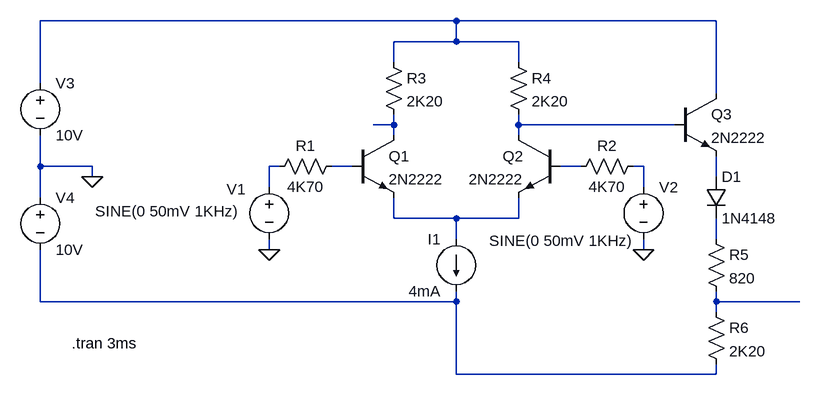
[diagram p0: schematic Exp4_PreLab_P2 copy.asc]
Exp4_PreLab_P2 copy.asc, the LTspice schematic file:
Version 4
SHEET 1 880 680
WIRE 144 -240 -496 -240
WIRE 544 -240 144 -240
WIRE 144 -208 144 -240
WIRE 144 -208 48 -208
WIRE 240 -208 144 -208
WIRE 48 -176 48 -208
WIRE 240 -176 240 -208
WIRE -496 -144 -496 -240
WIRE 544 -128 544 -240
WIRE 48 -80 48 -96
WIRE 48 -80 16 -80
WIRE 240 -80 240 -96
WIRE 480 -80 240 -80
WIRE 48 -64 48 -80
WIRE 240 -64 240 -80
WIRE -496 -16 -496 -64
WIRE -416 -16 -496 -16
WIRE -128 -16 -144 -16
WIRE -16 -16 -48 -16
WIRE 336 -16 304 -16
WIRE 432 -16 416 -16
WIRE -416 0 -416 -16
WIRE 544 0 544 -32
WIRE -144 16 -144 -16
WIRE 432 16 432 -16
WIRE -496 32 -496 -16
WIRE 48 64 48 32
WIRE 144 64 48 64
WIRE 240 64 240 32
WIRE 240 64 144 64
WIRE 144 96 144 64
WIRE 544 96 544 64
WIRE -144 112 -144 96
WIRE 432 112 432 96
WIRE -496 192 -496 112
WIRE 144 192 144 176
WIRE 144 192 -496 192
WIRE 544 192 544 176
WIRE 672 192 544 192
WIRE 544 208 544 192
WIRE 144 304 144 192
WIRE 544 304 544 288
WIRE 544 304 144 304
FLAG -144 112 0
FLAG 432 112 0
FLAG -416 0 0
SYMBOL voltage -144 0 M0
WINDOW 3 47 53 Left 2
WINDOW 0 36 19 Left 2
SYMATTR Value SINE(0 50mV 1KHz)
SYMATTR InstName V1
SYMBOL res -32 -32 R90
WINDOW 0 0 56 VBottom 2
WINDOW 3 32 56 VTop 2
SYMATTR InstName R1
SYMATTR Value 4K70
SYMBOL npn -16 -64 R0
SYMATTR InstName Q1
SYMATTR Value 2N2222
SYMBOL npn 304 -64 M0
SYMATTR InstName Q2
SYMATTR Value 2N2222
SYMBOL res 432 -32 R90
WINDOW 0 0 56 VBottom 2
WINDOW 3 32 56 VTop 2
SYMATTR InstName R2
SYMATTR Value 4K70
SYMBOL res 32 -192 R0
SYMATTR InstName R3
SYMATTR Value 2K20
SYMBOL res 224 -192 R0
SYMATTR InstName R4
SYMATTR Value 2K20
SYMBOL voltage -496 -160 R0
SYMATTR InstName V3
SYMATTR Value 10V
SYMBOL voltage -496 16 R0
SYMATTR InstName V4
SYMATTR Value 10V
SYMBOL current 144 96 M0
SYMATTR InstName I1
SYMATTR Value 4mA
SYMBOL voltage 432 0 R0
WINDOW 3 -237 98 Left 2
SYMATTR InstName V2
SYMATTR Value SINE(0 50mV 1KHz)
SYMBOL npn 480 -128 R0
SYMATTR InstName Q3
SYMATTR Value 2N2222
SYMBOL diode 528 0 R0
SYMATTR InstName D1
SYMATTR Value 1N4148
SYMBOL res 528 80 R0
SYMATTR InstName R5
SYMATTR Value 820
SYMBOL res 528 192 R0
SYMATTR InstName R6
SYMATTR Value 2K20
TEXT -448 256 Left 2 !.tran 3ms

The netlist it stands for:
* Exp4_PreLab_P2 copy.asc
V1 N004 0 SINE(0 50mV 1KHz)
R1 N005 N004 4K70
Q1 N002 N005 N009 0 2N2222
Q2 N003 N006 N009 0 2N2222
R2 N007 N006 4K70
R3 N001 N002 2K20
R4 N001 N003 2K20
V3 N001 0 10V
V4 0 N011 10V
I1 N009 N011 4mA
V2 N007 0 SINE(0 50mV 1KHz)
Q3 N001 N003 N008 0 2N2222
D1 N008 N010 1N4148
R5 N010 N012 820
R6 N012 N011 2K20
.model D D
.lib standard.dio
.model NPN NPN
.model PNP PNP
.lib standard.bjt
.tran 3ms
.backanno
.end